# EAGLE design CS-P-B9V (EAGLE 6.5.0)
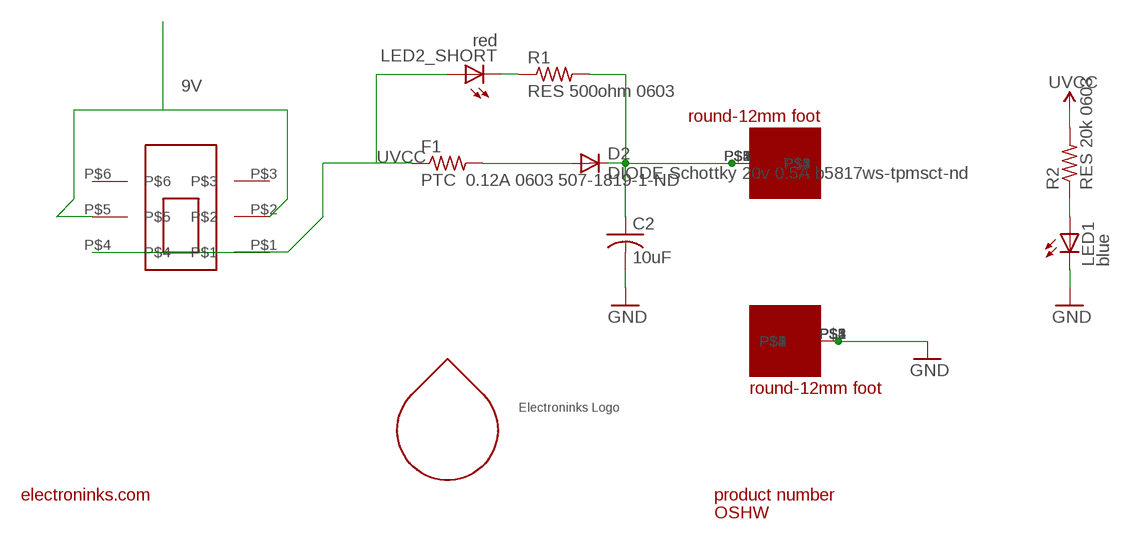
[diagram p0: schematic, sheet 1]

## Parts
C2  10uF  C-USC0805  [C0805]
D2  DIODE Schottky 20v 0.5A b5817ws-tpmsct-nd  DIODESOD  [SOD-323]
F1  PTC 0.12A 0603 507-1819-1-ND  R-US_R0603  [R0603]
LED1  blue  LEDSML0805  [SML0805]
LED2_SHORT  red  LEDSML0805  [SML0805]
R1  RES 500ohm 0603  R-US_R0603  [R0603]
R2  RES 20k 0603  R-US_R0603  [R0603]
U$1  563-1340-2-ND-SWITCH  [563-1340-2-ND-SWITCH]
U$2  ROUND-12MM-FOOT-1.8MM  [ROUND-12MM-FOOT]
U$3  ROUND-12MM-FOOT-1.8MM  [ROUND-12MM-FOOT]
U$4  ELECTRONINKS_LOGO_10MM  [ELECTRONINKS_LOGO_10MM]
U$5  DROPLET_LOGO_3MM  [DROPLET_LOGO_3MM]
U$6  OSHW_3MM  [OSHW_3MM]
U$7  ELECTRONINKS_COM_15MM  [ELECTRONINKS_COM_15MM]
U$8  CS_P_B9V  [CS_P_B9V]

## Nets
9V: U$1.P$2 U$1.P$5
GND [vcc]: C2.2 LED1.C U$2.P$1 U$2.P$2 U$2.P$3 U$2.P$4 U$2.P$5
N$1: LED1.A R2.1
N$2: LED2_SHORT.C R1.1
N$3: D2.2(A) F1.2
P$20: C2.1 D2.1(C) R1.2 U$3.P$1 U$3.P$2 U$3.P$3 U$3.P$4 U$3.P$5
UVCC: F1.1 LED2_SHORT.A R2.2 U$1.P$1 U$1.P$4
Unconnected: U$1.P$3 U$1.P$6

## Library data of the parts
C2 = rcl:C-US: CAPACITOR, American symbol
D2 = SparkFun:DIODE: Diode These are standard reverse protection diodes and small signal diodes. SMA package can handle up to about 1A. SOD-323 can handle about 200mA. What the SOD-323 package when ordering, there are some mfgs out there that are 5-pin packages.
F1 R1 R2 = rcl:R-US_: RESISTOR, American symbol
LED1 LED2_SHORT = led:LED: LED OSRAM: - CHIPLED LG R971, LG N971, LY N971, LG Q971, LY Q971, LO R971, LY R971 LH N974, LH R974 LS Q976, LO Q976, LY Q976 LO Q996 - Hyper CHIPLED LW Q18S LB Q993, LB Q99A, LB R99A - SideLED LS A670, LO A670, LY A670, LG A670, LP A670 LB A673, LV A673, LT A673, LW A673 LH A674 LY A675 LS A676, LA A676, LO A676, LY A676, LW A676 LS A679, LY A679, LG A679 - Hyper Micro SIDELED® LS Y876, LA Y876, LO Y876, LY Y876 LT Y87S - SmartLED LW L88C, LW L88S LB L89C, LB L89S, LG L890 LS L89K, LO L89K, LY L89K LS L896, LA L896, LO L896, LY L896 - TOPLED LS T670, LO T670, LY T670, LG T670, LP T670 LSG T670, LSP T670, LSY T670, LOP T670, LYG T670 LG T671, LOG T671, LSG T671 LB T673, LV T673, LT T673, LW T673 LH T674 LS T676, LA T676, LO T676, LY T676, LB T676, LH T676, LSB T676, LW T676 LB T67C, LV T67C, LT T67C, LS T67K, LO T67K, LY T67K, LW E67C LS E67B, LA E67B, LO E67B, LY E67B, LB E67C, LV E67C, LT E67C LW T67C LS T679, LY T679, LG T679 LS T770, LO T770, LY T770, LG T770, LP T770 LB T773, LV T773, LT T773, LW T773 LH T774 LS E675, LA E675, LY E675, LS T675 LS T776, LA T776, LO T776, LY T776, LB T776 LHGB T686 LT T68C, LB T68C - Hyper Mini TOPLED® LB M676 - Mini TOPLED Santana® LG M470 LS M47K, LO M47K, LY M47K Source: http://www.osram.convergy.de LUXEON: - LUMILED® LXK2-PW12-R00, LXK2-PW12-S00, LXK2-PW14-U00, LXK2-PW14-V00 LXK2-PM12-R00, LXK2-PM12-S00, LXK2-PM14-U00 LXK2-PE12-Q00, LXK2-PE12-R00, LXK2-PE12-S00, LXK2-PE14-T00, LXK2-PE14-U00 LXK2-PB12-K00, LXK2-PB12-L00, LXK2-PB12-M00, LXK2-PB14-N00, LXK2-PB14-P00, LXK2-PB14-Q00 LXK2-PR12-L00, LXK2-PR12-M00, LXK2-PR14-Q00, LXK2-PR14-R00 LXK2-PD12-Q00, LXK2-PD12-R00, LXK2-PD12-S00 LXK2-PH12-R00, LXK2-PH12-S00 LXK2-PL12-P00, LXK2-PL12-Q00, LXK2-PL12-R00 Source: www.luxeon.com KINGBRIGHT: KA-3528ASYC Source: www.kingbright.com
U$1 = electroninks:563-1340-2-ND-SWITCH
U$2 U$3 = electroninks:ROUND-12MM-FOOT-1.8MM
U$4 = electroninks:ELECTRONINKS_LOGO_10MM
U$5 = electroninks:DROPLET_LOGO_3MM
U$6 = electroninks:OSHW_3MM
U$7 = electroninks:ELECTRONINKS_COM_15MM
U$8 = electroninks:CS_P_B9V

## Net classes
0 default: width 0.203 mm

## Board
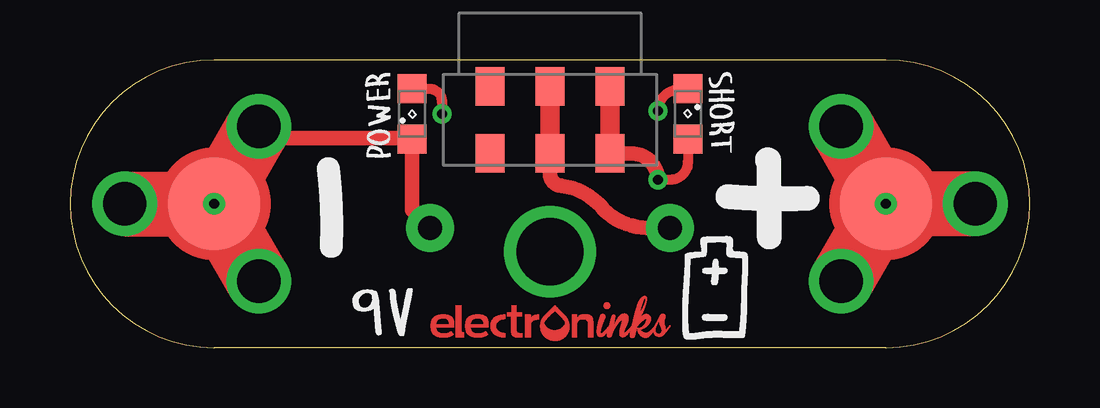
[diagram p1: board, top side]
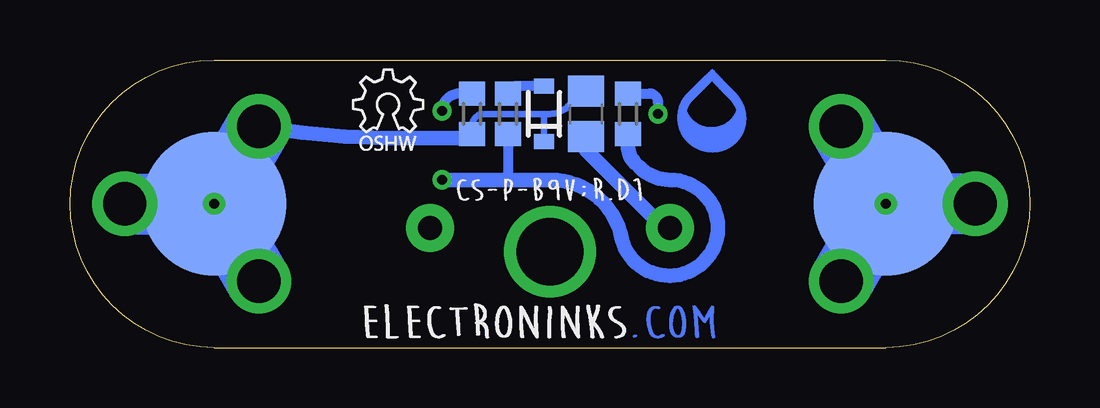
[diagram p2: board, bottom side, seen from below]

Size 40 x 12 mm. Coordinates in mm from the lower left corner, seen from the top.
Outline: 34,0 arc180 34,12 6,12 arc180 6,0 34,0
Copper layers (1*16): Top 0.035mm / dielectric 1.5mm / Bottom 0.035mm
Design rules "default": minimum track width 10mil, minimum drill 24mil, track to track 8mil, track to pad 8mil, pad to pad 8mil, via to via 8mil, smd to smd 8mil, copper to edge 40mil, drill to drill 8mil, minimum pad ring 10mil, minimum via ring 8mil, stop-mask expansion 4mil, vias tented up to drill 0mil, thermal gap 10mil

### Footprints (pad centres in the part's own frame; a part is rotated, then mirrored left to right if it is on the bottom)
C0805 = smd 1.3 x 1.5: 1 -0.95,0; 2 0.95,0
SOD-323 = smd 0.63 x 0.83: 1 -1.15,0; 2 1.15,0
R0603 = smd 1 x 1.1: 1 -0.85,0; 2 0.85,0
SML0805 = smd 1.2 x 1.2: A 1.05,0; C -1.05,0
563-1340-2-ND-SWITCH = smd 1.2 x 1.6: P$1 -2.5,-1.4; P$2 0,-1.4; P$3 2.5,-1.4; P$4 -2.5,1.4; P$5 0,1.4; P$6 2.5,1.4
ROUND-12MM-FOOT = drill 1.8: P$1 -3.726,0; P$2 1.863,3.227; P$3 1.863,-3.227 | smd 3.85 x 3.85: P$4 0,0 | smd 6 x 6 bottom: P$5 0,0 | drill 0.4: P$6 0,0

### Placement (x,y rotation side)
C2  18.5,9.75 270 bottom
D2  20.25,9.75 90 bottom
F1  21.75,9.75 90 bottom
LED1  14.25,9.75 90 top
LED2_SHORT  25.75,9.75 270 top
R1  23.25,9.75 270 bottom
R2  16.75,9.75 270 bottom
U$1  20,9.5 180 top
U$2  6,6 0 top
U$3  34,6 180 top
U$4  15.03,0.28 0 top
U$5  13.25,9.25 0 bottom
U$6  28.25,8 0 bottom
U$7  28,0 0 bottom
U$8  24,5.88 0 bottom

### Tracks (layer width: path | path; a pad name or v marks a point on that pad's centre or on a via)
9V  (via drill 1 pad 2)
  Top 0.61: U$1.P$5 20,7.25 arc90 20.5,6.75 arc-43 22.25,5.75 arc45 24.06,5 v25,5
  Top 0.813: U$1.P$2 U$1.P$5
GND  (via drill 1 pad 2)
  Top 0.406: 8.39,8.7 U$2.P$2
  Top 0.61: v15,5 14.25,5.75 LED1.C 14.2,8.75 8.34,8.75 U$2.P$2 | 7.75,8.75 6,7 U$2.P$5
  Bottom 0.61: C2.2 18.5,8.25 15.25,5 v15,5
N$1  (via drill 0.4)
  Top 0.406: LED1.A 14.95,10.8 arc-90 15.5,10.25 v15.5,9.75
  Bottom 0.406: R2.1 15.85,10.6 arc90 15.5,10.25 v15.5,9.75
N$2  (via drill 0.4)
  Top 0.305: 25.7,10.75 LED2_SHORT.C
  Top 0.406: 25.7,10.75 25.38,10.75 arc90 v24.5,9.88
  Bottom 0.406: R1.1 23.77,10.6 arc-90 v24.5,9.88
N$3
  Bottom 0.406: D2.2 21.5,10.9 F1.2
N$4  (via drill 2.8 pad 2.9)
  other vias: 20,4
P$20
  Bottom 0.275: R1.2 23.25,9.25 arc90 22.75,9.75 20.25,9.75 | 20.25,9.75 20,9.75 arc-74 19,10.5 arc104 C2.1 | D2.1 20.25,9.75
  Bottom 0.305: C2.1 18.3,10.7
  Bottom 0.61: 38,6.25 U$3.P$5 | R1.2 arc90 23.4,8.75 26.75,8.75 arc10 U$3.P$3
UVCC  (via drill 0.4)
  Top 0.406: LED2_SHORT.A 25.75,7.75 arc-90 25,7 v24.5,7
  Top 0.61: U$1.P$4 23.4,8.1 arc-90 v24.5,7
  Top 0.813: U$1.P$1 U$1.P$4
  Bottom 0.406: F1.1 21.75,7.25 arc-90 21.5,7
  Bottom 0.61: R2.2 16.75,8.41 arc-45 16.46,7.71 16.28,7.53 arc-45 15,7 arc180 15,3 arc76 17,4.5 arc-81 20,7 21.5,7 v24.5,7

### Text on the board
tDocu: SWITCH SIDE | LED BLUE 0805 | BLUE FEET | LED RED 0805 DIFF | BLUE FEET | GND - BLACK | +9V - RED | 9V Battery Cable (through top)
bDocu: Schottky 20v 0.5A Diode | CAP 10uF 0805 | PTC 0.10-0.2A | RES 500 0603 | RES 20k 0603